# Altium schematic sheet Sinewave_PWM_controller_3_PHASE.SchDoc
size A0; SheetNumber: 1; SheetTotal: 1; SPICEModelCacheYQEDCYZF: <root> / <DocumentId>YQEDCYZF</DocumentId> / </root>
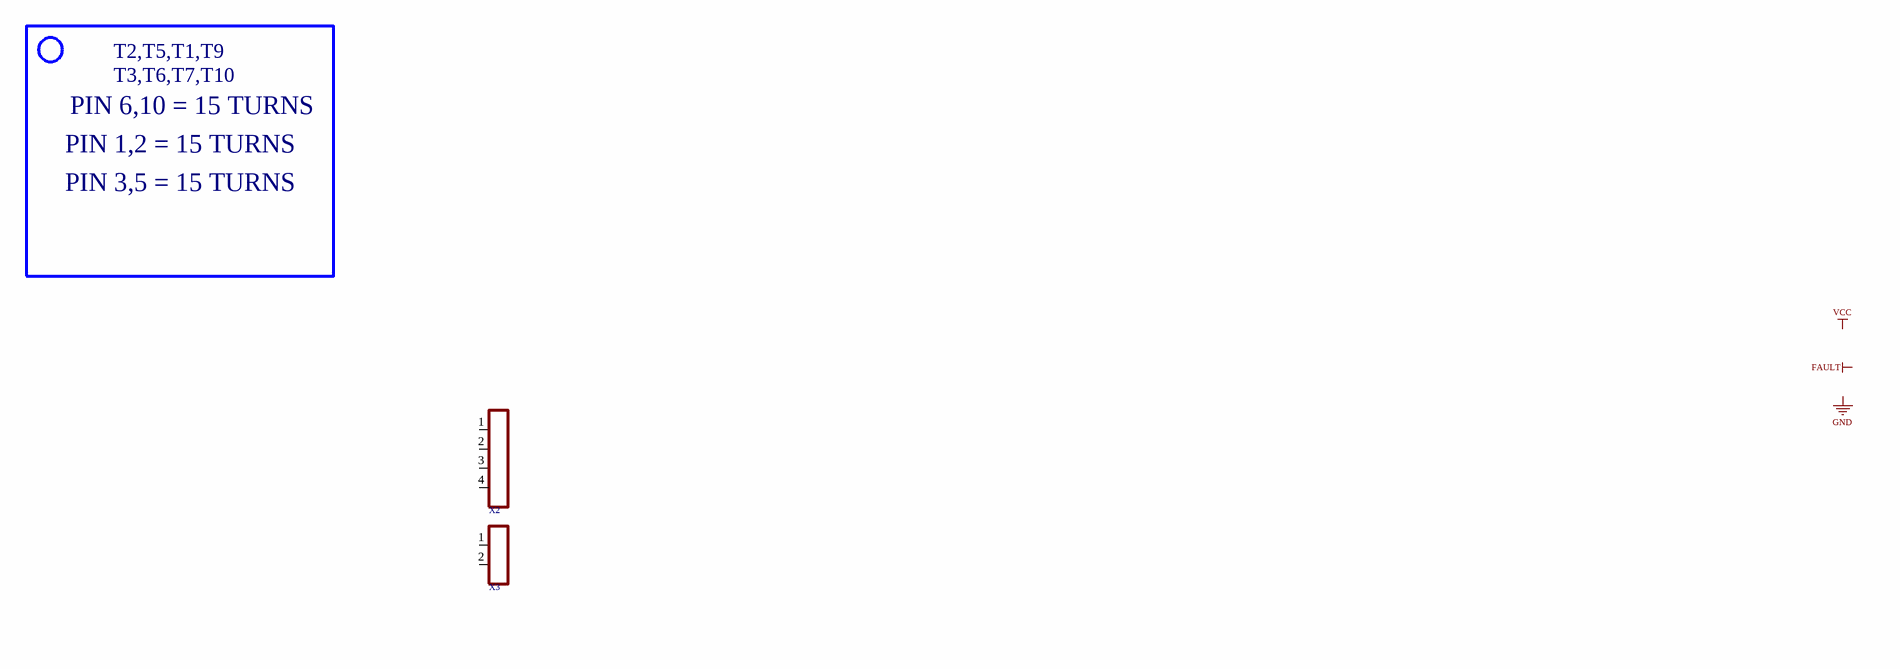
[diagram p0: Sinewave_PWM_controller_3_PHASE.SchDoc, top left]
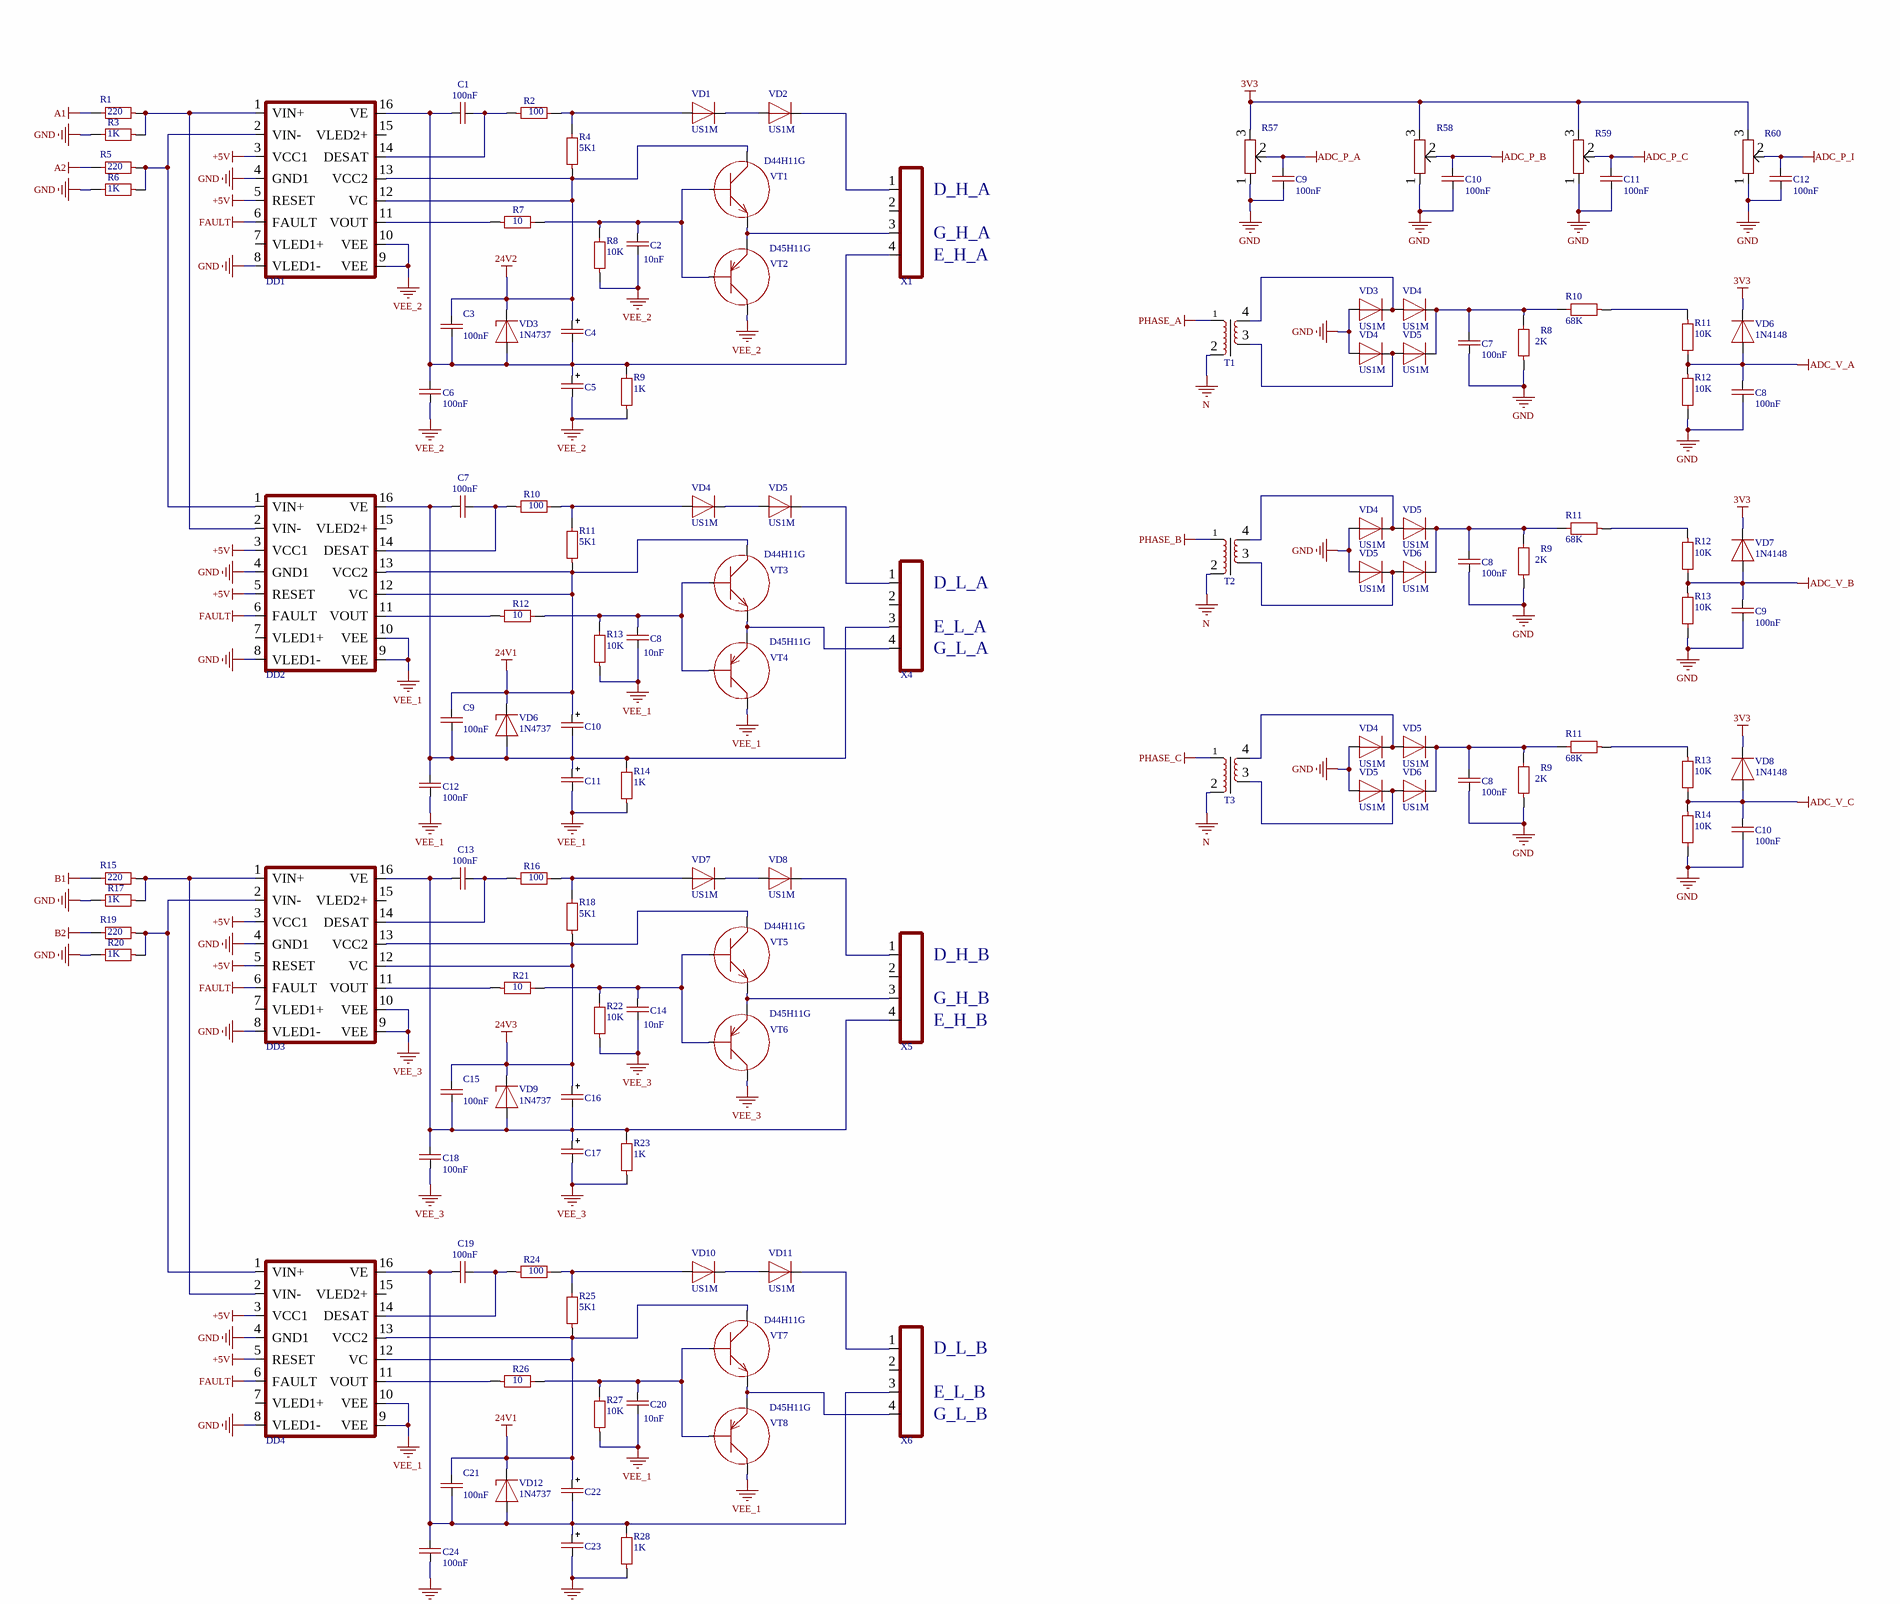
[diagram p1: Sinewave_PWM_controller_3_PHASE.SchDoc, top right]
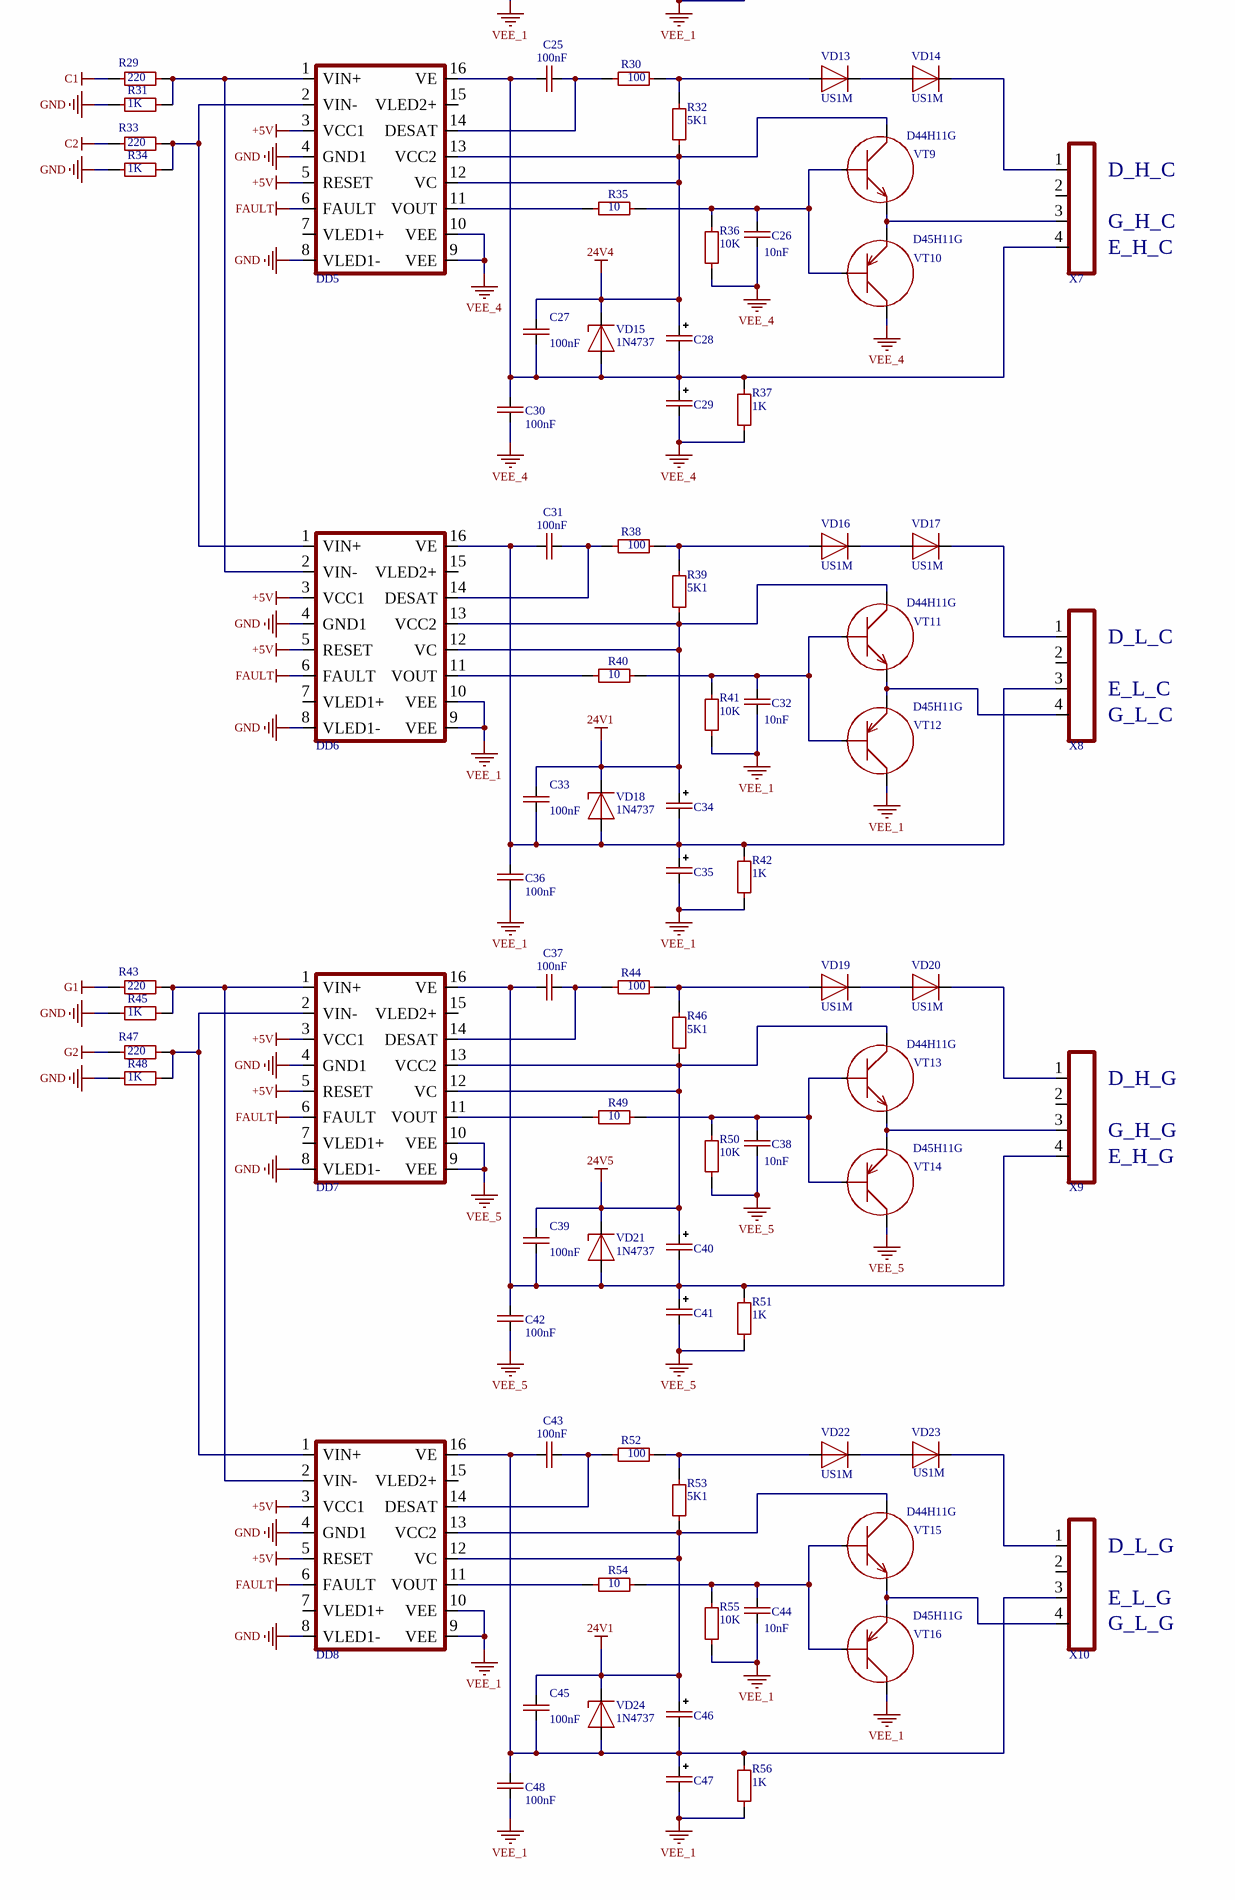
[diagram p2: Sinewave_PWM_controller_3_PHASE.SchDoc, bottom right]

## Parts
(Parts that share a designator on the sheet are numbered #1, #2 ... from top to bottom, then left to right.)
C1  100nF  [CAP-1206]
C2  10nF  [CAP-1206]
C3  100nF  [CAP-1206]
C4  CAP-POLAR  [CAPPOL8x12]  (value not drawn)
C5  CAP-POLAR  [CAPPOL8x12]  (value not drawn)
C6  100nF  [CAP-1206]
C7#1  100nF  [CAP-1206]
C7#2  100nF  [CAP-1206]
C8#1  100nF  [CAP-1206]
C8#2  100nF  [CAP-1206]
C8#3  10nF  [CAP-1206]
C8#4  100nF  [CAP-1206]
C9#1  100nF  [CAP-1206]
C9#2  100nF  [CAP-1206]
C9#3  100nF  [CAP-1206]
C10#1  100nF  [CAP-1206]
C10#2  CAP-POLAR  [CAPPOL8x12]  (value not drawn)
C10#3  100nF  [CAP-1206]
C11#1  100nF  [CAP-1206]
C11#2  CAP-POLAR  [CAPPOL8x12]  (value not drawn)
C12#1  100nF  [CAP-1206]
C12#2  100nF  [CAP-1206]
C13  100nF  [CAP-1206]
C14  10nF  [CAP-1206]
C15  100nF  [CAP-1206]
C16  CAP-POLAR  [CAPPOL8x12]  (value not drawn)
C17  CAP-POLAR  [CAPPOL8x12]  (value not drawn)
C18  100nF  [CAP-1206]
C19  100nF  [CAP-1206]
C20  10nF  [CAP-1206]
C21  100nF  [CAP-1206]
C22  CAP-POLAR  [CAPPOL8x12]  (value not drawn)
C23  CAP-POLAR  [CAPPOL8x12]  (value not drawn)
C24  100nF  [CAP-1206]
C25  100nF  [CAP-1206]
C26  10nF  [CAP-1206]
C27  100nF  [CAP-1206]
C28  CAP-POLAR  [CAPPOL8x12]  (value not drawn)
C29  CAP-POLAR  [CAPPOL8x12]  (value not drawn)
C30  100nF  [CAP-1206]
C31  100nF  [CAP-1206]
C32  10nF  [CAP-1206]
C33  100nF  [CAP-1206]
C34  CAP-POLAR  [CAPPOL8x12]  (value not drawn)
C35  CAP-POLAR  [CAPPOL8x12]  (value not drawn)
C36  100nF  [CAP-1206]
C37  100nF  [CAP-1206]
C38  10nF  [CAP-1206]
C39  100nF  [CAP-1206]
C40  CAP-POLAR  [CAPPOL8x12]  (value not drawn)
C41  CAP-POLAR  [CAPPOL8x12]  (value not drawn)
C42  100nF  [CAP-1206]
C43  100nF  [CAP-1206]
C44  10nF  [CAP-1206]
C45  100nF  [CAP-1206]
C46  CAP-POLAR  [CAPPOL8x12]  (value not drawn)
C47  CAP-POLAR  [CAPPOL8x12]  (value not drawn)
C48  100nF  [CAP-1206]
DD1  HCPL-316J  [SO16_W]  (value not drawn)
DD2  HCPL-316J  [SO16_W]  (value not drawn)
DD3  HCPL-316J  [SO16_W]  (value not drawn)
DD4  HCPL-316J  [SO16_W]  (value not drawn)
DD5  HCPL-316J  [SO16_W]  (value not drawn)
DD6  HCPL-316J  [SO16_W]  (value not drawn)
DD7  HCPL-316J  [SO16_W]  (value not drawn)
DD8  HCPL-316J  [SO16_W]  (value not drawn)
R1  220  [RES-0805]
R2  100  [RES-0805]
R3  1K  [RES-0805]
R4  5K1  [RES-0805]
R5  220  [RES-0805]
R6  1K  [RES-0805]
R7  10  [RES-1206]
R8#1  10K  [RES-0805]
R8#2  2K  [RES-1206]
R9#1  1K  [RES-0805]
R9#2  2K  [RES-1206]
R9#3  2K  [RES-1206]
R10#1  68K  [RES-0805]
R10#2  100  [RES-0805]
R11#1  10K  [RES-0805]
R11#2  68K  [RES-0805]
R11#3  5K1  [RES-0805]
R11#4  68K  [RES-0805]
R12#1  10K  [RES-0805]
R12#2  10K  [RES-0805]
R12#3  10  [RES-1206]
R13#1  10K  [RES-0805]
R13#2  10K  [RES-0805]
R13#3  10K  [RES-0805]
R14#1  1K  [RES-0805]
R14#2  10K  [RES-0805]
R15  220  [RES-0805]
R16  100  [RES-0805]
R17  1K  [RES-0805]
R18  5K1  [RES-0805]
R19  220  [RES-0805]
R20  1K  [RES-0805]
R21  10  [RES-1206]
R22  10K  [RES-0805]
R23  1K  [RES-0805]
R24  100  [RES-0805]
R25  5K1  [RES-0805]
R26  10  [RES-1206]
R27  10K  [RES-0805]
R28  1K  [RES-0805]
R29  220  [RES-0805]
R30  100  [RES-0805]
R31  1K  [RES-0805]
R32  5K1  [RES-0805]
R33  220  [RES-0805]
R34  1K  [RES-0805]
R35  10  [RES-1206]
R36  10K  [RES-0805]
R37  1K  [RES-0805]
R38  100  [RES-0805]
R39  5K1  [RES-0805]
R40  10  [RES-1206]
R41  10K  [RES-0805]
R42  1K  [RES-0805]
R43  220  [RES-0805]
R44  100  [RES-0805]
R45  1K  [RES-0805]
R46  5K1  [RES-0805]
R47  220  [RES-0805]
R48  1K  [RES-0805]
R49  10  [RES-1206]
R50  10K  [RES-0805]
R51  1K  [RES-0805]
R52  100  [RES-0805]
R53  5K1  [RES-0805]
R54  10  [RES-1206]
R55  10K  [RES-0805]
R56  1K  [RES-0805]
R57  3296  [3296W]  (value not drawn)
R58  3296  [3296W]  (value not drawn)
R59  3296  [3296W]  (value not drawn)
R60  3296  [3296W]  (value not drawn)
T1  TRANS_220_12  [TRANS_220_12]  (value not drawn)
T2  TRANS_220_12  [TRANS_220_12]  (value not drawn)
T3  TRANS_220_12  [TRANS_220_12]  (value not drawn)
VD1  US1M  [DO-214BA]
VD2  US1M  [DO-214BA]
VD3#1  US1M  [DO-214BA]
VD3#2  1N4737  [DO-41]
VD4#1  US1M  [DO-214BA]
VD4#2  US1M  [DO-214BA]
VD4#3  US1M  [DO-214BA]
VD4#4  US1M  [DO-214BA]
VD4#5  US1M  [DO-214BA]
VD5#1  US1M  [DO-214BA]
VD5#2  US1M  [DO-214BA]
VD5#3  US1M  [DO-214BA]
VD5#4  US1M  [DO-214BA]
VD5#5  US1M  [DO-214BA]
VD5#6  US1M  [DO-214BA]
VD6#1  1N4148  [SOD-123]
VD6#2  US1M  [DO-214BA]
VD6#3  1N4737  [DO-41]
VD6#4  US1M  [DO-214BA]
VD7#1  1N4148  [SOD-123]
VD7#2  US1M  [DO-214BA]
VD8#1  1N4148  [SOD-123]
VD8#2  US1M  [DO-214BA]
VD9  1N4737  [DO-41]
VD10  US1M  [DO-214BA]
VD11  US1M  [DO-214BA]
VD12  1N4737  [DO-41]
VD13  US1M  [DO-214BA]
VD14  US1M  [DO-214BA]
VD15  1N4737  [DO-41]
VD16  US1M  [DO-214BA]
VD17  US1M  [DO-214BA]
VD18  1N4737  [DO-41]
VD19  US1M  [DO-214BA]
VD20  US1M  [DO-214BA]
VD21  1N4737  [DO-41]
VD22  US1M  [DO-214BA]
VD23  US1M  [DO-214BA]
VD24  1N4737  [DO-41]
VT1  D44H11G  [TO-220-3]
VT2  D45H11G  [TO-220-3]
VT3  D44H11G  [TO-220-3]
VT4  D45H11G  [TO-220-3]
VT5  D44H11G  [TO-220-3]
VT6  D45H11G  [TO-220-3]
VT7  D44H11G  [TO-220-3]
VT8  D45H11G  [TO-220-3]
VT9  D44H11G  [TO-220-3]
VT10  D45H11G  [TO-220-3]
VT11  D44H11G  [TO-220-3]
VT12  D45H11G  [TO-220-3]
VT13  D44H11G  [TO-220-3]
VT14  D45H11G  [TO-220-3]
VT15  D44H11G  [TO-220-3]
VT16  D45H11G  [TO-220-3]
X1  CONN-4-PIN  [CONN-PLS-4-2.54mm_1]  (value not drawn)
X2  CONN-4-PIN  [CONN-PLS-4-2.54mm_1]  (value not drawn)
X3  CONN-2-PIN  [XH2-]  (value not drawn)
X4  CONN-4-PIN  [CONN-PLS-4-2.54mm_1]  (value not drawn)
X5  CONN-4-PIN  [CONN-PLS-4-2.54mm_1]  (value not drawn)
X6  CONN-4-PIN  [CONN-PLS-4-2.54mm_1]  (value not drawn)
X7  CONN-4-PIN  [CONN-PLS-4-2.54mm_1]  (value not drawn)
X8  CONN-4-PIN  [CONN-PLS-4-2.54mm_1]  (value not drawn)
X9  CONN-4-PIN  [CONN-PLS-4-2.54mm_1]  (value not drawn)
X10  CONN-4-PIN  [CONN-PLS-4-2.54mm_1]  (value not drawn)

## Nets
3V3: R57.3 R58.3 R59.3 R60.3 VD6#1.1(C) VD7#1.1(C) VD8#1.1(C)
24V1: C9#3.2 C10#2.1(+) C21.2 C22.1(+) C33.2 C34.1(+) C45.2 C46.1(+) DD2.12(VC) DD2.13(VCC2) DD4.12(VC) DD4.13(VCC2) DD6.12(VC) DD6.13(VCC2) DD8.12(VC) DD8.13(VCC2) R11#3.1 R25.1 R39.1 R53.1 VD6#3.1(C) VD12.1(C) VD18.1(C) VD24.1(C) VT3.2(C) VT7.2(C) VT11.2(C) VT15.2(C)
24V2: C3.2 C4.1(+) DD1.12(VC) DD1.13(VCC2) R4.1 VD3#2.1(C) VT1.2(C)
24V3: C15.2 C16.1(+) DD3.12(VC) DD3.13(VCC2) R18.1 VD9.1(C) VT5.2(C)
24V4: C27.2 C28.1(+) DD5.12(VC) DD5.13(VCC2) R32.1 VD15.1(C) VT9.2(C)
24V5: C39.2 C40.1(+) DD7.12(VC) DD7.13(VCC2) R46.1 VD21.1(C) VT13.2(C)
+5V: DD1.3(VCC1) DD1.5(RESET) DD2.3(VCC1) DD2.5(RESET) DD3.3(VCC1) DD3.5(RESET) DD4.3(VCC1) DD4.5(RESET) DD5.3(VCC1) DD5.5(RESET) DD6.3(VCC1) DD6.5(RESET) DD7.3(VCC1) DD7.5(RESET) DD8.3(VCC1) DD8.5(RESET)
A1: R1.2
A2: R5.2
ADC_P_A: C9#1.2 R57.2
ADC_P_B: C10#1.2 R58.2
ADC_P_C: C11#1.2 R59.2
ADC_P_I: C12#1.2 R60.2
ADC_V_A: C8#1.2 R11#1.2 R12#1.1 VD6#1.2(A)
ADC_V_B: C9#2.2 R12#2.2 R13#1.1 VD7#1.2(A)
ADC_V_C: C10#3.2 R13#3.2 R14#2.1 VD8#1.2(A)
B1: R15.2
B2: R19.2
C1: R29.2
C2: R33.2
FAULT: DD1.6(FAULT) DD2.6(FAULT) DD3.6(FAULT) DD4.6(FAULT) DD5.6(FAULT) DD6.6(FAULT) DD7.6(FAULT) DD8.6(FAULT)
G1: R43.2
G2: R47.2
GND: C7#1.1 C8#1.1 C8#2.1 C8#4.1 C9#1.1 C9#2.1 C10#1.1 C10#3.1 C11#1.1 C12#1.1 DD1.4(GND1) DD1.8(VLED1-) DD2.4(GND1) DD2.8(VLED1-) DD3.4(GND1) DD3.8(VLED1-) DD4.4(GND1) DD4.8(VLED1-) DD5.4(GND1) DD5.8(VLED1-) DD6.4(GND1) DD6.8(VLED1-) DD7.4(GND1) DD7.8(VLED1-) DD8.4(GND1) DD8.8(VLED1-) R3.2 R6.2 R8#2.1 R9#2.1 R9#3.1 R12#1.2 R13#1.2 R14#2.2 R17.2 R20.2 R31.2 R34.2 R45.2 R48.2 R57.1 R58.1 R59.1 R60.1 VD3#1.2(A) VD4#2.2(A) VD4#4.2(A) VD4#5.2(A) VD5#4.2(A) VD5#6.2(A)
N: T1.2 T2.2 T3.2
PHASE_A: T1.1
PHASE_B: T2.1
PHASE_C: T3.1
VEE_1: C8#3.2 C11#2.2(-) C12#2.2 C20.2 C23.2(-) C24.2 C32.2 C35.2(-) C36.2 C44.2 C47.2(-) C48.2 DD2.9(VEE) DD2.10(VEE) DD4.9(VEE) DD4.10(VEE) DD6.9(VEE) DD6.10(VEE) DD8.9(VEE) DD8.10(VEE) R13#2.1 R14#1.1 R27.1 R28.1 R41.1 R42.1 R55.1 R56.1 VT4.2(C) VT8.2(C) VT12.2(C) VT16.2(C)
VEE_2: C2.2 C5.2(-) C6.2 DD1.9(VEE) DD1.10(VEE) R8#1.1 R9#1.1 VT2.2(C)
VEE_3: C14.2 C17.2(-) C18.2 DD3.9(VEE) DD3.10(VEE) R22.1 R23.1 VT6.2(C)
VEE_4: C26.2 C29.2(-) C30.2 DD5.9(VEE) DD5.10(VEE) R36.1 R37.1 VT10.2(C)
VEE_5: C38.2 C41.2(-) C42.2 DD7.9(VEE) DD7.10(VEE) R50.1 R51.1 VT14.2(C)
NetC1_1: C1.1 DD1.14(DESAT) R2.1
NetC1_2: C1.2 C3.1 C4.2(-) C5.1(+) C6.1 DD1.16(VE) R9#1.2 VD3#2.2(A) X1.4
NetC2_1: C2.1 R7.2 R8#1.2 VT1.1(B) VT2.1(B)
NetC7#1_2: C7#1.2 R8#2.2 R10#1.2 VD4#1.1(C) VD5#1.1(C)
NetC7#2_1: C7#2.1 DD2.14(DESAT) R10#2.1
NetC7#2_2: C7#2.2 C9#3.1 C10#2.2(-) C11#2.1(+) C12#2.1 DD2.16(VE) R14#1.2 VD6#3.2(A) X4.3
NetC8#2_2: C8#2.2 R9#2.2 R11#2.2 VD5#3.1(C) VD6#2.1(C)
NetC8#3_1: C8#3.1 R12#3.2 R13#2.2 VT3.1(B) VT4.1(B)
NetC8#4_2: C8#4.2 R9#3.2 R11#4.2 VD5#5.1(C) VD6#4.1(C)
NetC13_1: C13.1 DD3.14(DESAT) R16.1
NetC13_2: C13.2 C15.1 C16.2(-) C17.1(+) C18.1 DD3.16(VE) R23.2 VD9.2(A) X5.4
NetC14_1: C14.1 R21.2 R22.2 VT5.1(B) VT6.1(B)
NetC19_1: C19.1 DD4.14(DESAT) R24.1
NetC19_2: C19.2 C21.1 C22.2(-) C23.1(+) C24.1 DD4.16(VE) R28.2 VD12.2(A) X6.3
NetC20_1: C20.1 R26.2 R27.2 VT7.1(B) VT8.1(B)
NetC25_1: C25.1 DD5.14(DESAT) R30.1
NetC25_2: C25.2 C27.1 C28.2(-) C29.1(+) C30.1 DD5.16(VE) R37.2 VD15.2(A) X7.4
NetC26_1: C26.1 R35.2 R36.2 VT9.1(B) VT10.1(B)
NetC31_1: C31.1 DD6.14(DESAT) R38.1
NetC31_2: C31.2 C33.1 C34.2(-) C35.1(+) C36.1 DD6.16(VE) R42.2 VD18.2(A) X8.3
NetC32_1: C32.1 R40.2 R41.2 VT11.1(B) VT12.1(B)
NetC37_1: C37.1 DD7.14(DESAT) R44.1
NetC37_2: C37.2 C39.1 C40.2(-) C41.1(+) C42.1 DD7.16(VE) R51.2 VD21.2(A) X9.4
NetC38_1: C38.1 R49.2 R50.2 VT13.1(B) VT14.1(B)
NetC43_1: C43.1 DD8.14(DESAT) R52.1
NetC43_2: C43.2 C45.1 C46.2(-) C47.1(+) C48.1 DD8.16(VE) R56.2 VD24.2(A) X10.3
NetC44_1: C44.1 R54.2 R55.2 VT15.1(B) VT16.1(B)
NetDD1_1: DD1.1(VIN+) DD2.2(VIN-) R1.1 R3.1
NetDD1_2: DD1.2(VIN-) DD2.1(VIN+) R5.1 R6.1
NetDD1_11: DD1.11(VOUT) R7.1
NetDD2_11: DD2.11(VOUT) R12#3.1
NetDD3_1: DD3.1(VIN+) DD4.2(VIN-) R15.1 R17.1
NetDD3_2: DD3.2(VIN-) DD4.1(VIN+) R19.1 R20.1
NetDD3_11: DD3.11(VOUT) R21.1
NetDD4_11: DD4.11(VOUT) R26.1
NetDD5_1: DD5.1(VIN+) DD6.2(VIN-) R29.1 R31.1
NetDD5_2: DD5.2(VIN-) DD6.1(VIN+) R33.1 R34.1
NetDD5_11: DD5.11(VOUT) R35.1
NetDD6_11: DD6.11(VOUT) R40.1
NetDD7_1: DD7.1(VIN+) DD8.2(VIN-) R43.1 R45.1
NetDD7_2: DD7.2(VIN-) DD8.1(VIN+) R47.1 R48.1
NetDD7_11: DD7.11(VOUT) R49.1
NetDD8_11: DD8.11(VOUT) R54.1
NetR2_2: R2.2 R4.2 VD1.2(A)
NetR10#1_1: R10#1.1 R11#1.1
NetR10#2_2: R10#2.2 R11#3.2 VD4#3.2(A)
NetR11#2_1: R11#2.1 R12#2.1
NetR11#4_1: R11#4.1 R13#3.1
NetR16_2: R16.2 R18.2 VD7#2.2(A)
NetR24_2: R24.2 R25.2 VD10.2(A)
NetR30_2: R30.2 R32.2 VD13.2(A)
NetR38_2: R38.2 R39.2 VD16.2(A)
NetR44_2: R44.2 R46.2 VD19.2(A)
NetR52_2: R52.2 R53.2 VD22.2(A)
NetT1_3: T1.3 VD4#2.1(C) VD5#1.2(A)
NetT1_4: T1.4 VD3#1.1(C) VD4#1.2(A)
NetT2_3: T2.3 VD5#4.1(C) VD6#2.2(A)
NetT2_4: T2.4 VD4#4.1(C) VD5#3.2(A)
NetT3_3: T3.3 VD5#6.1(C) VD6#4.2(A)
NetT3_4: T3.4 VD4#5.1(C) VD5#5.2(A)
NetVD1_1: VD1.1(C) VD2.2(A)
NetVD2_1: VD2.1(C) X1.1
NetVD4#3_1: VD4#3.1(C) VD5#2.2(A)
NetVD5#2_1: VD5#2.1(C) X4.1
NetVD7#2_1: VD7#2.1(C) VD8#2.2(A)
NetVD8#2_1: VD8#2.1(C) X5.1
NetVD10_1: VD10.1(C) VD11.2(A)
NetVD11_1: VD11.1(C) X6.1
NetVD13_1: VD13.1(C) VD14.2(A)
NetVD14_1: VD14.1(C) X7.1
NetVD16_1: VD16.1(C) VD17.2(A)
NetVD17_1: VD17.1(C) X8.1
NetVD19_1: VD19.1(C) VD20.2(A)
NetVD20_1: VD20.1(C) X9.1
NetVD22_1: VD22.1(C) VD23.2(A)
NetVD23_1: VD23.1(C) X10.1
NetVT1_3: VT1.3(E) VT2.3(E) X1.3
NetVT3_3: VT3.3(E) VT4.3(E) X4.4
NetVT5_3: VT5.3(E) VT6.3(E) X5.3
NetVT7_3: VT7.3(E) VT8.3(E) X6.4
NetVT9_3: VT9.3(E) VT10.3(E) X7.3
NetVT11_3: VT11.3(E) VT12.3(E) X8.4
NetVT13_3: VT13.3(E) VT14.3(E) X9.3
NetVT15_3: VT15.3(E) VT16.3(E) X10.4

Not connected (* = marked no-connect by the designer): DD1 7(VLED1+) 15(VLED2+); DD2 7(VLED1+) 15(VLED2+); DD3 7(VLED1+) 15(VLED2+); DD4 7(VLED1+) 15(VLED2+); DD5 7(VLED1+) 15(VLED2+); DD6 7(VLED1+) 15(VLED2+); DD7 7(VLED1+) 15(VLED2+); DD8 7(VLED1+) 15(VLED2+); X1 2; X2 1 2 3 4; X3 1 2; X4 2; X5 2; X6 2; X7 2; X8 2; X9 2; X10 2

## Notes on the sheet
- T2,T5,T1,T9
- T3,T6,T7,T10
- PIN 6,10 = 15 TURNS
- PIN 1,2 = 15 TURNS
- PIN 3,5 = 15 TURNS
- (near X1) D_H_A
- (near X1) G_H_A
- (near X1) E_H_A
- (near X4) D_L_A
- (near X4) G_L_A
- (near X4) E_L_A
- (near X5) D_H_B
- (near X5) G_H_B
- (near X5) E_H_B
- (near X6) D_L_B
- (near X6) E_L_B
- (near X6) G_L_B
- (near X7) D_H_C
- (near X7) G_H_C
- (near X7) E_H_C
- (near X8) D_L_C
- (near X8) E_L_C
- (near X8) G_L_C
- (near X9) D_H_G
- (near X9) G_H_G
- (near X9) E_H_G
- (near X10) D_L_G
- (near X10) G_L_G
- (near X10) E_L_G
- Labels drawn without touching a wire or pin: FAULT, GND, VCC

## Library data of the parts
C1-C3 C6 C7#1 C7#2 C8#1-C8#4 C9#1-C9#3 C10#1 C10#3 C11#1 C12#1 C12#2 C13-C15 C18-C21 C24-C27 C30-C33 C36-C39 C42-C45 C48 = CAP-NON-POLAR
R1-R7 R8#1 R8#2 R9#1-R9#3 R10#1 R10#2 R11#1-R11#4 R12#1-R12#3 R13#1-R13#3 R14#1 R14#2 R15-R56 = RES-CONST
VD1 VD2 VD3#1 VD4#1-VD4#5 VD5#1-VD5#6 VD6#1 VD6#2 VD6#4 VD7#1 VD7#2 VD8#1 VD8#2 VD10 VD11 VD13 VD14 VD16 VD17 VD19 VD20 VD22 VD23 = DIODE
VD3#2 VD6#3 VD9 VD12 VD15 VD18 VD21 VD24 = ZENER
VT1 VT3 VT5 VT7 VT9 VT11 VT13 VT15 = BIPOLAR-NPN-BEC
VT2 VT4 VT6 VT8 VT10 VT12 VT14 VT16 = BIPOLAR-PNP-BCE